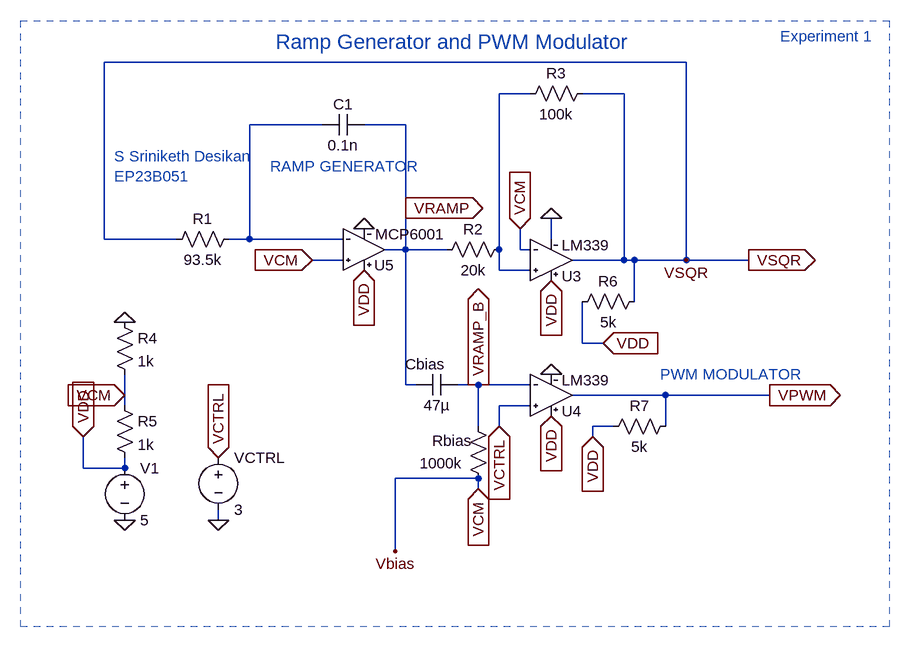
[diagram p0: schematic Experiment 1 - Ramp generator and PWM modulator.asc]
Experiment 1 - Ramp generator and PWM modulator.asc, the LTspice schematic file:
Version 4
SHEET 1 3440 1196
WIRE 864 -112 -32 -112
WIRE 624 -64 576 -64
WIRE 768 -64 704 -64
WIRE 304 -16 192 -16
WIRE 432 -16 368 -16
WIRE 432 112 432 -16
WIRE -32 160 -32 -112
WIRE 80 160 -32 160
WIRE 192 160 192 -16
WIRE 192 160 160 160
WIRE 336 160 192 160
WIRE 656 160 656 128
WIRE 432 176 432 112
WIRE 432 176 400 176
WIRE 496 176 432 176
WIRE 576 176 576 -64
WIRE 608 176 608 144
WIRE 624 176 608 176
WIRE 336 192 288 192
WIRE 768 192 768 -64
WIRE 768 192 688 192
WIRE 784 192 768 192
WIRE 864 192 864 -112
WIRE 864 192 784 192
WIRE 960 192 864 192
WIRE 576 208 576 176
WIRE 624 208 576 208
WIRE 784 256 784 192
WIRE 704 320 704 256
WIRE 736 320 704 320
WIRE 432 384 432 176
WIRE 448 384 432 384
WIRE 544 384 512 384
WIRE 624 384 544 384
WIRE 0 400 0 368
WIRE 832 400 688 400
WIRE 992 400 832 400
WIRE 0 416 0 400
WIRE 624 416 576 416
WIRE 544 448 544 384
WIRE 576 448 576 416
WIRE 752 448 720 448
WIRE 832 448 832 400
WIRE 720 464 720 448
WIRE -64 512 -64 464
WIRE 0 512 0 496
WIRE 0 512 -64 512
WIRE 544 528 416 528
WIRE 544 544 544 528
WIRE 144 592 144 576
WIRE 416 640 416 528
FLAG 0 400 VCM
IOPIN 0 400 In
FLAG 544 384 VRAMP_B
IOPIN 544 384 Out
FLAG 864 192 VSQR
FLAG 144 592 0
FLAG 144 496 VCTRL
IOPIN 144 496 In
FLAG 0 592 0
FLAG 288 192 VCM
IOPIN 288 192 In
FLAG 608 144 VCM
IOPIN 608 144 In
FLAG 992 400 VPWM
IOPIN 992 400 Out
FLAG 432 112 VRAMP
IOPIN 432 112 Out
FLAG 576 448 VCTRL
IOPIN 576 448 In
FLAG 0 288 0
FLAG 960 192 VSQR
IOPIN 960 192 Out
FLAG 368 144 0
FLAG 656 128 0
FLAG 656 368 0
FLAG 368 208 VDD
IOPIN 368 208 In
FLAG 656 224 VDD
IOPIN 656 224 In
FLAG 656 432 VDD
IOPIN 656 432 In
FLAG 736 320 VDD
IOPIN 736 320 In
FLAG 720 464 VDD
IOPIN 720 464 In
FLAG -64 464 VDD
IOPIN -64 464 In
FLAG 544 544 VCM
IOPIN 544 544 In
FLAG 416 640 Vbias
SYMBOL Res 592 160 R90
WINDOW 0 0 56 VBottom 2
WINDOW 3 32 56 VTop 2
SYMATTR InstName R2
SYMATTR Value 20k
SYMBOL Res 720 -80 R90
WINDOW 0 0 56 VBottom 2
WINDOW 3 32 56 VTop 2
SYMATTR InstName R3
SYMATTR Value 100k
SYMBOL Res 176 144 R90
WINDOW 0 0 56 VBottom 2
WINDOW 3 32 56 VTop 2
SYMATTR InstName R1
SYMATTR Value 93.5k
SYMBOL Cap 368 -32 R90
WINDOW 0 0 32 VBottom 2
WINDOW 3 32 32 VTop 2
SYMATTR InstName C1
SYMATTR Value 0.1n
SYMBOL Cap 512 368 R90
WINDOW 0 0 50 VBottom 2
WINDOW 3 32 32 VTop 2
SYMATTR InstName Cbias
SYMATTR Value 47µ
SYMBOL Voltage 144 480 R0
SYMATTR InstName VCTRL
SYMATTR Value 3
SYMBOL Res -16 272 R0
SYMATTR InstName R4
SYMATTR Value 1k
SYMBOL Res 528 432 R0
WINDOW 0 -55 38 Left 2
WINDOW 3 -74 73 Left 2
SYMATTR InstName Rbias
SYMATTR Value 1000k
SYMBOL Voltage 0 496 R0
SYMATTR InstName V1
SYMATTR Value 5
SYMBOL MCP6001 368 176 M180
SYMATTR InstName U5
SYMBOL LM339 688 192 M180
SYMATTR InstName U3
SYMBOL LM339 688 400 M180
SYMATTR InstName U4
SYMBOL Res 800 240 R90
WINDOW 0 0 56 VBottom 2
WINDOW 3 32 56 VTop 2
SYMATTR InstName R6
SYMATTR Value 5k
SYMBOL Res 848 432 R90
WINDOW 0 0 56 VBottom 2
WINDOW 3 32 56 VTop 2
SYMATTR InstName R7
SYMATTR Value 5k
SYMBOL Res -16 400 R0
SYMATTR InstName R5
SYMATTR Value 1k
TEXT 224 48 Left 2 ;RAMP GENERATOR
TEXT 824 368 Left 2 ;PWM MODULATOR
TEXT -16 32 Left 2 ;S Sriniketh Desikan\nEP23B051
TEXT 232 -144 Left 3 ;Ramp Generator and PWM Modulator
TEXT 1008 -152 Left 2 ;Experiment 1
RECTANGLE Normal -160 -176 1176 756 2

The netlist it stands for:
* Experiment 1 - Ramp generator and PWM modulator.asc
R2 N001 VRAMP 20k
R3 VSQR N001 100k
R1 N002 VSQR 93.5k
C1 VRAMP N002 0.1n
Cbias VRAMP_B VRAMP 47µ
VCTRL VCTRL 0 3
R4 0 Vbias 1k
Rbias VRAMP_B Vbias 1000k
V1 VDD 0 5
XU5 Vbias N002 VDD 0 VRAMP MCP6001
XU3 N001 Vbias VDD 0 VSQR LM339
XU4 VCTRL VRAMP_B VDD 0 VPWM LM339
R6 VSQR VDD 5k
R7 VPWM VDD 5k
R5 Vbias VDD 1k
* RAMP GENERATOR
* PWM MODULATOR
* S Sriniketh Desikan
* EP23B051
* Ramp Generator and PWM Modulator
* Experiment 1
.lib ./MCP6001.lib
.lib ./LM339.lib
.backanno
.end